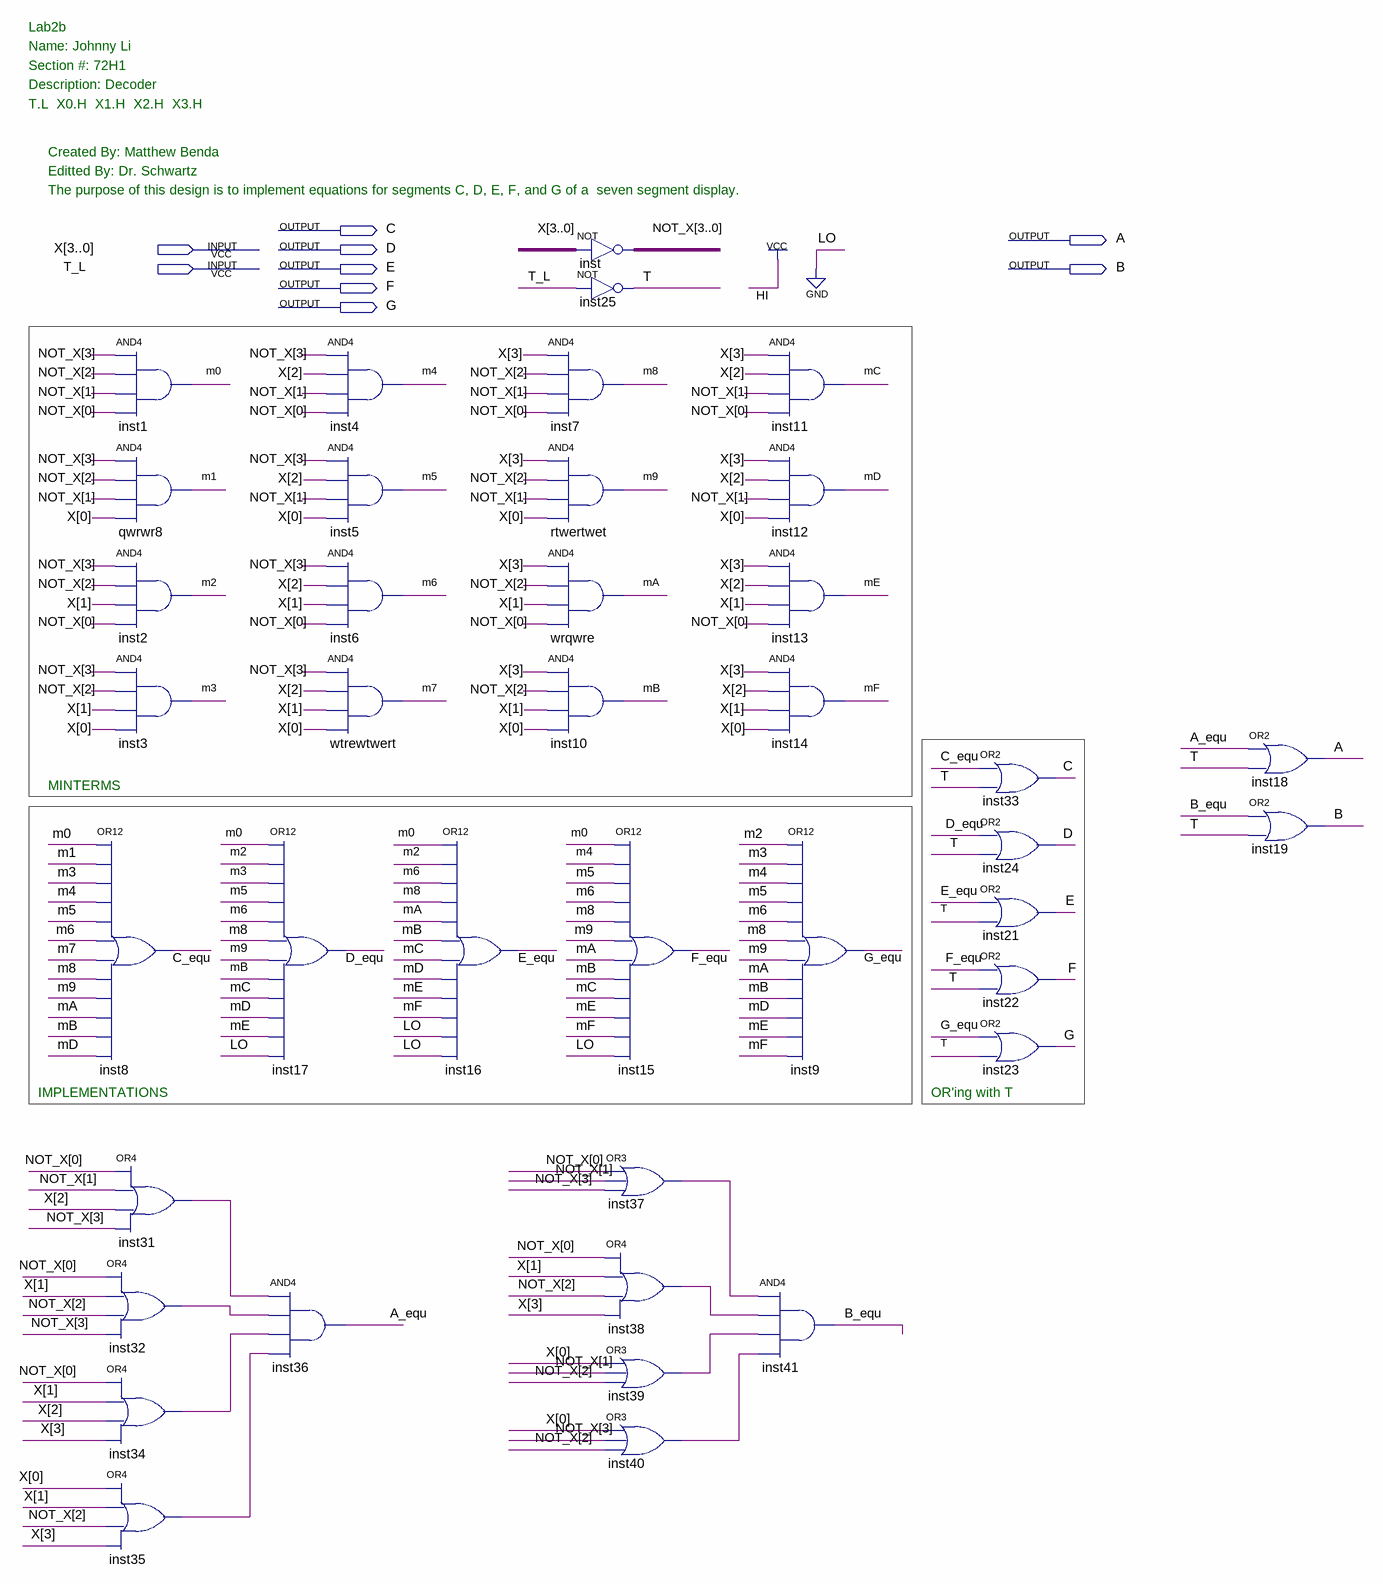
[diagram p0: schematic sheet]
// Quartus schematic lab2_decoder.bdf as structural Verilog: 40 symbols, 9 pins
module lab2_decoder (
  input  [3:0] X,
  input  T_L,
  output C,
  output A,
  output D,
  output E,
  output B,
  output F,
  output G
);

  wire A_equ, B_equ, C_equ, D_equ, E_equ, F_equ, G_equ, inst31_out, inst32_out, inst34_out, inst35_out,
       inst37_out, inst38_out, inst39_out, inst40_out, m0, m1, m2, m3, m4, m5, m6, m7, m8, m9, mA, mB, mC,
       mD, mE, mF, T;
  wire [3:0] NOT_X;

  and inst1 (m0, NOT_X[3], NOT_X[2], NOT_X[1], NOT_X[0]);
  and qwrwr8 (m1, NOT_X[3], NOT_X[2], NOT_X[1], X[0]);
  and inst2 (m2, NOT_X[3], NOT_X[2], X[1], NOT_X[0]);
  and inst3 (m3, NOT_X[3], NOT_X[2], X[1], X[0]);
  or inst8 (C_equ, m0, m1, m3, m4, m5, m6, m7, m8, m9, mA, mB, mD);
  or inst31 (inst31_out, NOT_X[0], NOT_X[1], X[2], NOT_X[3]);
  or inst32 (inst32_out, NOT_X[0], X[1], NOT_X[2], NOT_X[3]);
  or inst34 (inst34_out, NOT_X[0], X[1], X[2], X[3]);
  or inst35 (inst35_out, X[0], X[1], NOT_X[2], X[3]);
  or inst17 (D_equ, m0, m2, m3, m5, m6, m8, m9, mB, mC, mD, mE, 1'b0);
  and inst36 (A_equ, inst31_out, inst32_out, inst34_out, inst35_out);
  and inst4 (m4, NOT_X[3], X[2], NOT_X[1], NOT_X[0]);
  and inst5 (m5, NOT_X[3], X[2], NOT_X[1], X[0]);
  and inst6 (m6, NOT_X[3], X[2], X[1], NOT_X[0]);
  and wtrewtwert (m7, NOT_X[3], X[2], X[1], X[0]);
  or inst16 (E_equ, m0, m2, m6, m8, mA, mB, mC, mD, mE, mF, 1'b0, 1'b0);
  assign NOT_X = ~X;  // NOT inst, 4 bits wide
  not inst25 (T, T_L);
  and inst7 (m8, X[3], NOT_X[2], NOT_X[1], NOT_X[0]);
  and rtwertwet (m9, X[3], NOT_X[2], NOT_X[1], X[0]);
  and wrqwre (mA, X[3], NOT_X[2], X[1], NOT_X[0]);
  and inst10 (mB, X[3], NOT_X[2], X[1], X[0]);
  or inst15 (F_equ, m0, m4, m5, m6, m8, m9, mA, mB, mC, mE, mF, 1'b0);
  or inst37 (inst37_out, NOT_X[0], NOT_X[1], NOT_X[3]);
  or inst38 (inst38_out, NOT_X[0], X[1], NOT_X[2], X[3]);
  or inst39 (inst39_out, X[0], NOT_X[1], NOT_X[2]);
  or inst40 (inst40_out, X[0], NOT_X[3], NOT_X[2]);
  and inst11 (mC, X[3], X[2], NOT_X[1], NOT_X[0]);
  and inst12 (mD, X[3], X[2], NOT_X[1], X[0]);
  and inst13 (mE, X[3], X[2], X[1], NOT_X[0]);
  and inst14 (mF, X[3], X[2], X[1], X[0]);
  or inst9 (G_equ, m2, m3, m4, m5, m6, m8, m9, mA, mB, mD, mE, mF);
  and inst41 (B_equ, inst37_out, inst38_out, inst39_out, inst40_out);
  or inst33 (C, C_equ, T);
  or inst24 (D, D_equ, T);
  or inst21 (E, E_equ, T);
  or inst22 (F, F_equ, T);
  or inst23 (G, G_equ, T);
  or inst18 (A, A_equ, T);
  or inst19 (B, B_equ, T);

  // Notes on the sheet:
  //   Lab2b
  //   Name: Johnny Li
  //   Section #: 72H1
  //   Description: Decoder
  //   T.L  X0.H  X1.H  X2.H  X3.H
  //   Created By: Matthew Benda
  //   Editted By: Dr. Schwartz
  //   The purpose of this design is to implement equations for segments C, D, E, F, and G of a  seven segment display.            
  //   MINTERMS
  //   IMPLEMENTATIONS
  //   OR'ing with T
endmodule
